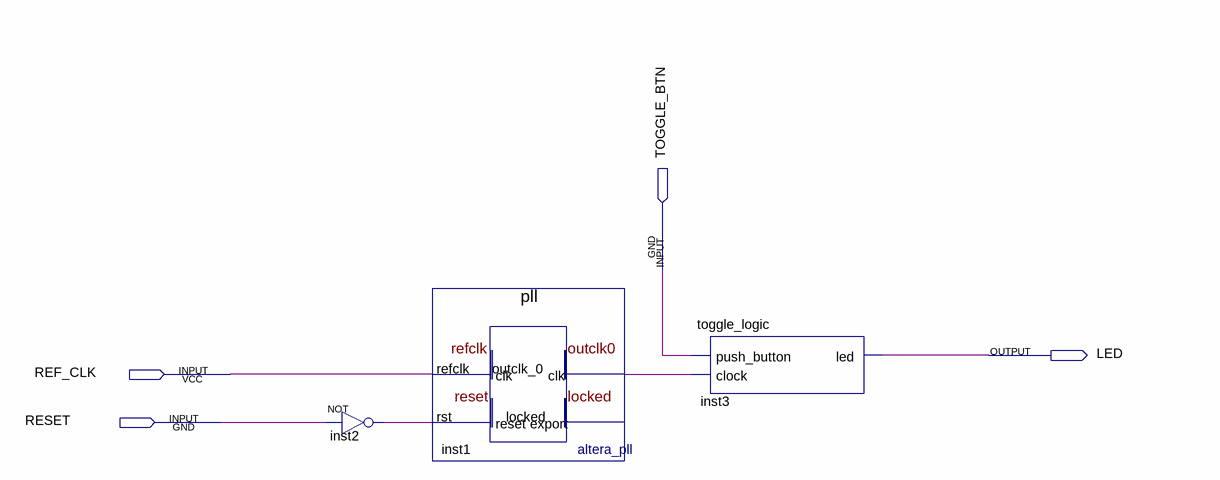
[diagram p0: schematic sheet]
// Quartus schematic manual-toggle.bdf as structural Verilog: 3 symbols, 4 pins
module \manual-toggle  (
  input  TOGGLE_BTN,
  input  REF_CLK,
  input  RESET,
  output LED
);

  wire inst1_outclk_0, inst2_out;

  not inst2 (inst2_out, RESET);
  pll inst1 (.refclk(REF_CLK), .rst(inst2_out), .outclk_0(inst1_outclk_0));  // open: locked
  toggle_logic inst3 (.push_button(TOGGLE_BTN), .clock(inst1_outclk_0), .led(LED));
endmodule
